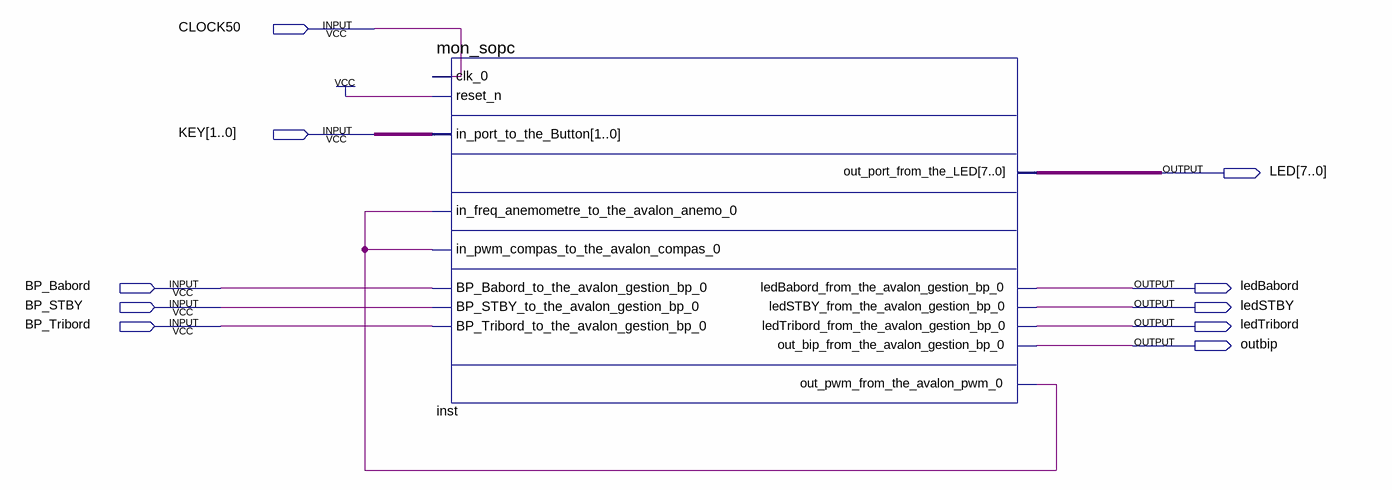
[diagram p0: schematic sheet]
// Quartus schematic sopc_projet.bdf as structural Verilog: 1 symbols, 10 pins
module sopc_projet (
  input  CLOCK50,
  input  [1:0] KEY,
  input  BP_Babord,
  input  BP_STBY,
  input  BP_Tribord,
  output [7:0] LED,
  output ledBabord,
  output ledSTBY,
  output ledTribord,
  output outbip
);

  wire inst_out_pwm_from_the_avalon_pwm_0;

  mon_sopc inst (
    .clk_0(CLOCK50), .reset_n(1'b1), .in_port_to_the_Button(KEY),
    .in_freq_anemometre_to_the_avalon_anemo_0(inst_out_pwm_from_the_avalon_pwm_0),
    .in_pwm_compas_to_the_avalon_compas_0(inst_out_pwm_from_the_avalon_pwm_0),
    .BP_Babord_to_the_avalon_gestion_bp_0(BP_Babord), .BP_STBY_to_the_avalon_gestion_bp_0(BP_STBY),
    .BP_Tribord_to_the_avalon_gestion_bp_0(BP_Tribord), .out_port_from_the_LED(LED),
    .ledBabord_from_the_avalon_gestion_bp_0(ledBabord), .ledSTBY_from_the_avalon_gestion_bp_0(ledSTBY),
    .ledTribord_from_the_avalon_gestion_bp_0(ledTribord), .out_bip_from_the_avalon_gestion_bp_0(outbip),
    .out_pwm_from_the_avalon_pwm_0(inst_out_pwm_from_the_avalon_pwm_0));
endmodule
